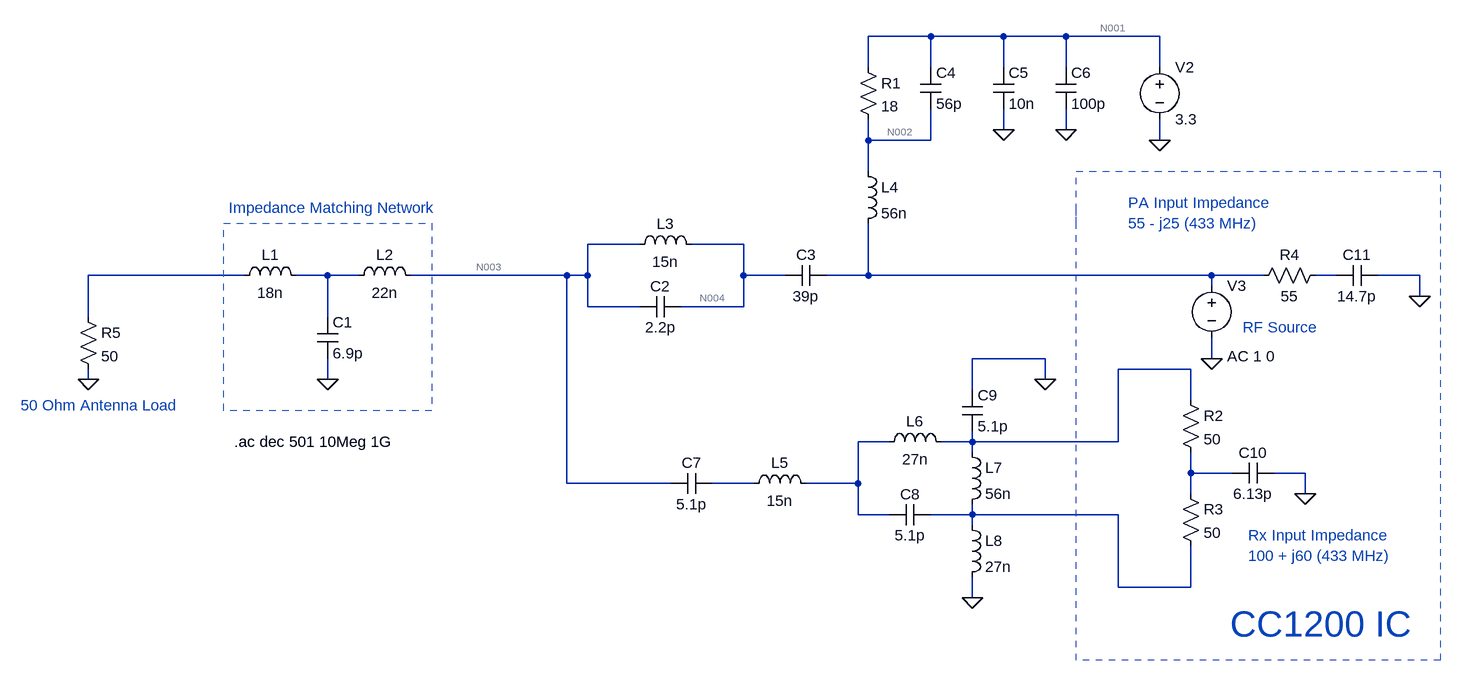
[diagram p0: schematic CC1200 Front End Model.asc]
CC1200 Front End Model.asc, the LTspice schematic file:
Version 4
SHEET 1 1652 708
WIRE 864 -256 768 -256
WIRE 976 -256 864 -256
WIRE 1072 -256 976 -256
WIRE 1216 -256 1072 -256
WIRE 768 -208 768 -256
WIRE 864 -208 864 -256
WIRE 976 -208 976 -256
WIRE 1072 -208 1072 -256
WIRE 1216 -208 1216 -256
WIRE 976 -112 976 -144
WIRE 1072 -112 1072 -144
WIRE 768 -96 768 -128
WIRE 864 -96 864 -144
WIRE 864 -96 768 -96
WIRE 1216 -96 1216 -128
WIRE 768 -48 768 -96
WIRE 416 64 336 64
WIRE 576 64 496 64
WIRE -192 112 -432 112
WIRE -64 112 -112 112
WIRE -16 112 -64 112
WIRE 304 112 64 112
WIRE 336 112 336 64
WIRE 336 112 304 112
WIRE 576 112 576 64
WIRE 640 112 576 112
WIRE 768 112 768 32
WIRE 768 112 704 112
WIRE 1296 112 768 112
WIRE 1376 112 1296 112
WIRE 1488 112 1456 112
WIRE 1616 112 1552 112
WIRE 1296 128 1296 112
WIRE 1616 144 1616 112
WIRE 336 160 336 112
WIRE 416 160 336 160
WIRE 576 160 576 112
WIRE 576 160 480 160
WIRE -432 176 -432 112
WIRE -64 176 -64 112
WIRE 1040 240 928 240
WIRE 1296 240 1296 208
WIRE 1264 256 1152 256
WIRE -432 272 -432 256
WIRE -64 272 -64 240
WIRE 1040 272 1040 240
WIRE 928 288 928 240
WIRE 1264 304 1264 256
WIRE 800 368 752 368
WIRE 928 368 928 352
WIRE 928 368 880 368
WIRE 1152 368 1152 256
WIRE 1152 368 928 368
WIRE 928 384 928 368
WIRE 1264 416 1264 384
WIRE 1328 416 1264 416
WIRE 1440 416 1392 416
WIRE 304 432 304 112
WIRE 464 432 304 432
WIRE 592 432 528 432
WIRE 752 432 752 368
WIRE 752 432 672 432
WIRE 1264 448 1264 416
WIRE 1440 448 1440 416
WIRE 752 480 752 432
WIRE 800 480 752 480
WIRE 928 480 928 464
WIRE 928 480 864 480
WIRE 1152 480 928 480
WIRE 928 496 928 480
WIRE 1152 592 1152 480
WIRE 1264 592 1264 528
WIRE 1264 592 1152 592
WIRE 928 608 928 576
FLAG -64 272 0
FLAG -432 272 0
FLAG 976 -112 0
FLAG 1072 -112 0
FLAG 1216 -96 0
FLAG 1040 272 0
FLAG 928 608 0
FLAG 1440 448 0
FLAG 1616 144 0
FLAG 1296 240 0
SYMBOL ind -208 128 R270
WINDOW 0 32 56 VTop 2
WINDOW 3 5 56 VBottom 2
SYMATTR InstName L1
SYMATTR Value 18n
SYMBOL cap -80 176 R0
SYMATTR InstName C1
SYMATTR Value 6.9p
SYMBOL ind -32 128 R270
WINDOW 0 32 56 VTop 2
WINDOW 3 5 56 VBottom 2
SYMATTR InstName L2
SYMATTR Value 22n
SYMBOL ind 400 80 R270
WINDOW 0 32 56 VTop 2
WINDOW 3 5 56 VBottom 2
SYMATTR InstName L3
SYMATTR Value 15n
SYMBOL cap 480 144 R90
WINDOW 0 0 32 VBottom 2
WINDOW 3 32 32 VTop 2
SYMATTR InstName C2
SYMATTR Value 2.2p
SYMBOL cap 704 96 R90
WINDOW 0 0 32 VBottom 2
WINDOW 3 32 32 VTop 2
SYMATTR InstName C3
SYMATTR Value 39p
SYMBOL ind 752 -64 R0
SYMATTR InstName L4
SYMATTR Value 56n
SYMBOL res 752 -224 R0
SYMATTR InstName R1
SYMATTR Value 18
SYMBOL cap 848 -208 R0
SYMATTR InstName C4
SYMATTR Value 56p
SYMBOL cap 960 -208 R0
SYMATTR InstName C5
SYMATTR Value 10n
SYMBOL cap 1056 -208 R0
SYMATTR InstName C6
SYMATTR Value 100p
SYMBOL voltage 1216 -224 R0
WINDOW 123 0 0 Left 0
WINDOW 39 0 0 Left 0
SYMATTR InstName V2
SYMATTR Value 3.3
SYMBOL cap 528 416 R90
WINDOW 0 0 32 VBottom 2
WINDOW 3 32 32 VTop 2
SYMATTR InstName C7
SYMATTR Value 5.1p
SYMBOL ind 576 448 R270
WINDOW 0 32 56 VTop 2
WINDOW 3 5 56 VBottom 2
SYMATTR InstName L5
SYMATTR Value 15n
SYMBOL ind 784 384 R270
WINDOW 0 32 56 VTop 2
WINDOW 3 5 56 VBottom 2
SYMATTR InstName L6
SYMATTR Value 27n
SYMBOL cap 864 464 R90
WINDOW 0 0 32 VBottom 2
WINDOW 3 32 32 VTop 2
SYMATTR InstName C8
SYMATTR Value 5.1p
SYMBOL ind 912 368 R0
SYMATTR InstName L7
SYMATTR Value 56n
SYMBOL ind 912 480 R0
SYMATTR InstName L8
SYMATTR Value 27n
SYMBOL cap 912 288 R0
SYMATTR InstName C9
SYMATTR Value 5.1p
SYMBOL res 1248 288 R0
SYMATTR InstName R2
SYMATTR Value 50
SYMBOL res 1248 432 R0
SYMATTR InstName R3
SYMATTR Value 50
SYMBOL cap 1392 400 R90
WINDOW 0 0 32 VBottom 2
WINDOW 3 32 32 VTop 2
SYMATTR InstName C10
SYMATTR Value 6.13p
SYMBOL res 1472 96 R90
WINDOW 0 0 56 VBottom 2
WINDOW 3 32 56 VTop 2
SYMATTR InstName R4
SYMATTR Value 55
SYMBOL cap 1552 96 R90
WINDOW 0 0 32 VBottom 2
WINDOW 3 32 32 VTop 2
SYMATTR InstName C11
SYMATTR Value 14.7p
SYMBOL voltage 1296 112 R0
WINDOW 123 24 124 Left 2
WINDOW 39 0 0 Left 0
SYMATTR Value2 AC 1 0
SYMATTR InstName V3
SYMATTR Value ""
SYMBOL res -448 160 R0
SYMATTR InstName R5
SYMATTR Value 50
TEXT 1168 0 Left 2 ;PA Input Impedance
TEXT 1168 32 Left 2 ;55 - j25 (433 MHz)
TEXT 1352 512 Left 2 ;Rx Input Impedance\n100 + j60 (433 MHz)
TEXT -208 368 Left 2 !.ac dec 501 10Meg 1G
TEXT 1464 648 Center 5 ;CC1200 IC
TEXT -216 8 Left 2 ;Impedance Matching Network
TEXT -536 312 Left 2 ;50 Ohm Antenna Load
TEXT 1344 192 Left 2 ;RF Source
LINE Normal 1088 704 1088 0 2
LINE Normal 1088 704 1088 704 2
LINE Normal 1648 704 1088 704 2
LINE Normal 1088 -48 1632 -48 2
LINE Normal 1088 32 1088 -48 2
LINE Normal 1088 32 1088 32 2
LINE Normal 1648 -48 1648 704 2
LINE Normal 1616 -48 1648 -48 2
RECTANGLE Normal 96 320 -224 32 2

The netlist it stands for:
* CC1200 Front End Model.asc
L1 N005 N006 18n
C1 N006 0 6.9p
L2 N006 N003 22n
L3 N003 N004 15n
C2 N004 N003 2.2p
C3 N007 N004 39p
L4 N002 N007 56n
R1 N001 N002 18
C4 N001 N002 56p
C5 N001 0 10n
C6 N001 0 100p
V2 N001 0 3.3
C7 N012 N003 5.1p
L5 N012 N010 15n
L6 N010 N009 27n
C8 N013 N010 5.1p
L7 N009 N013 56n
L8 N013 0 27n
C9 0 N009 5.1p
R2 N009 N011 50
R3 N011 N013 50
C10 0 N011 6.13p
R4 N008 N007 55
C11 0 N008 14.7p
V3 N007 0 AC 1 0
R5 N005 0 50
* PA Input Impedance
* 55 - j25 (433 MHz)
* Rx Input Impedance
* 100 + j60 (433 MHz)
.ac dec 501 10Meg 1G
* CC1200 IC
* Impedance Matching Network
* 50 Ohm Antenna Load
* RF Source
.backanno
.end

* Results of the author's LTspice run, read from the files saved beside the schematic
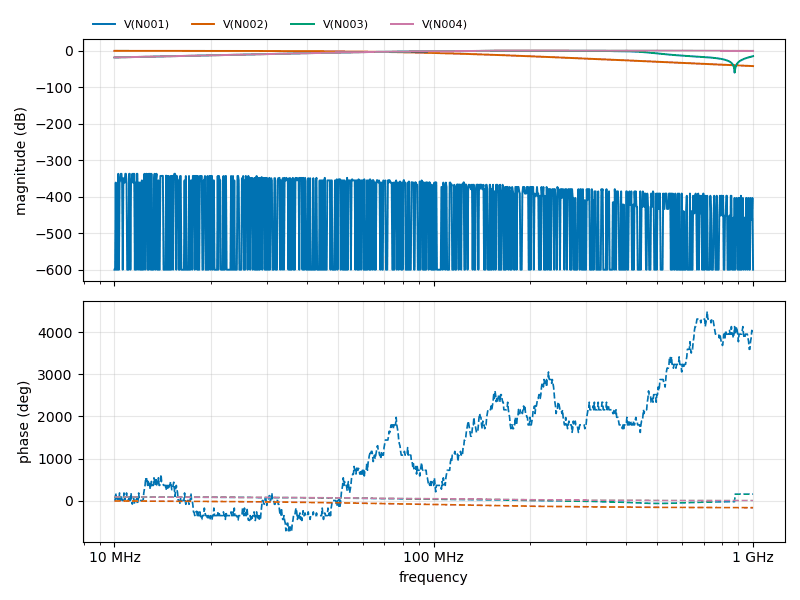
[diagram p1: AC Analysis of CC1200 Front End Model.asc, plotted from the saved traces]
* AC Analysis, 1 run:
*   V(N001): -600.00 dB at 10 MHz, -600.00 dB at 1 GHz, peak -337.00 dB at 12.58 MHz, 3 dB below the peak at 12.57 MHz and 12.59 MHz
*   V(N002): -0.06 dB at 10 MHz, -41.89 dB at 1 GHz, peak -0.06 dB at 10 MHz, 3 dB below the peak at 70.01 MHz
*   V(N003): -18.26 dB at 10 MHz, -14.75 dB at 1 GHz, peak 0.18 dB at 165 MHz, 3 dB below the peak at 68.12 MHz and 441.4 MHz
*   V(N004): -18.25 dB at 10 MHz, -0.13 dB at 1 GHz, peak 1.11 dB at 168.1 MHz, 3 dB below the peak at 79.13 MHz